# EAGLE schematic LED Cube V6 (EAGLE 8.4.0)
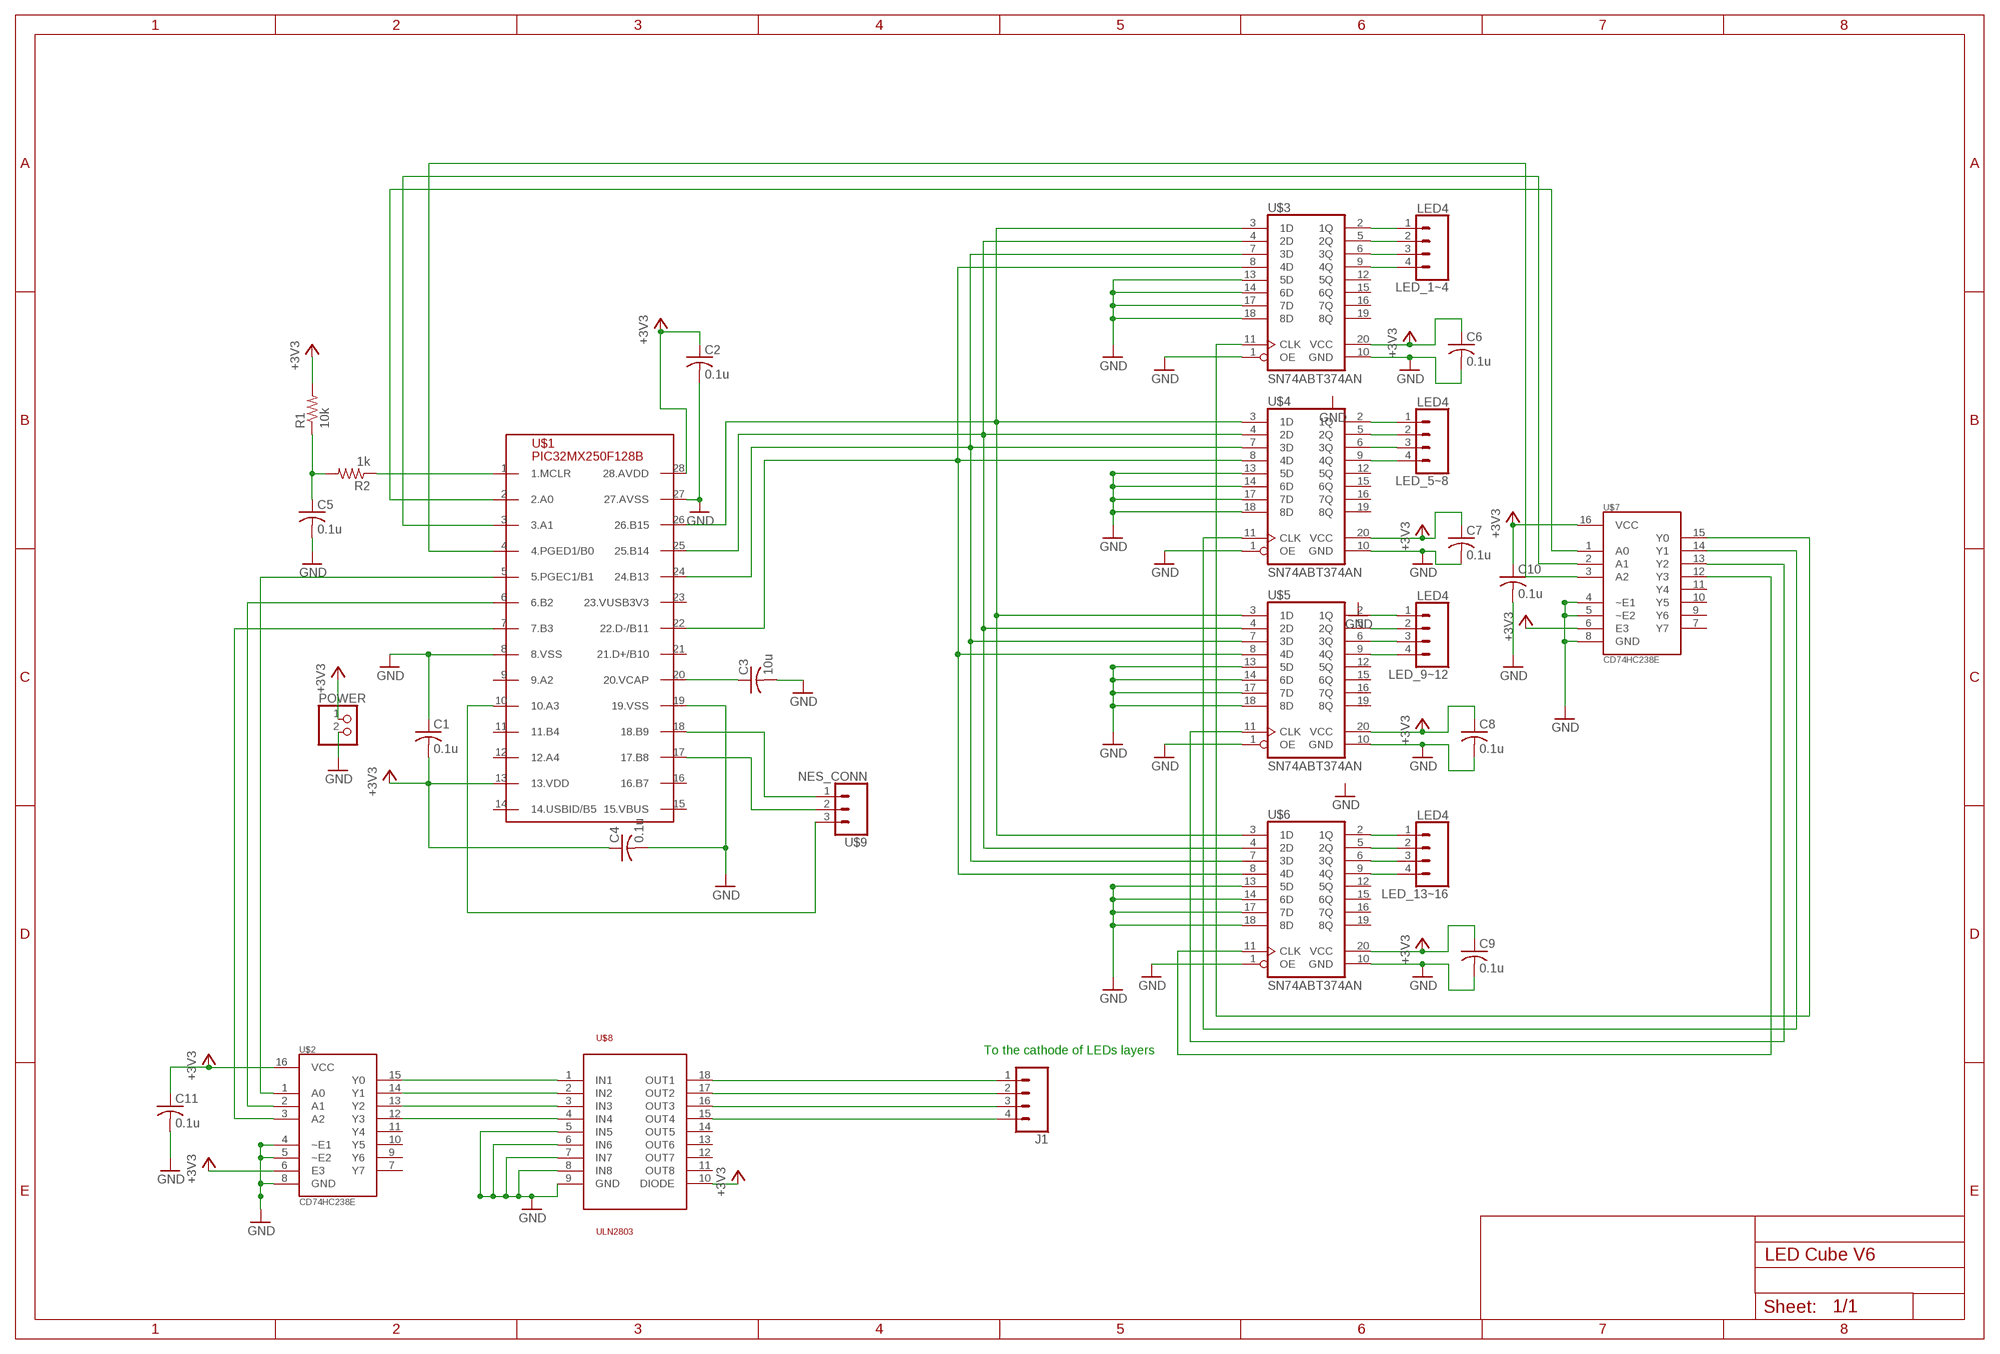
[diagram p0: schematic, sheet 1]

## Parts
C1  0.1u  C-US025-025X050  [C025-025X050]
C2  0.1u  C-US025-025X050  [C025-025X050]
C3  10u  C-US025-025X050  [C025-025X050]
C4  0.1u  C-US025-025X050  [C025-025X050]
C5  0.1u  C-US025-025X050  [C025-025X050]
C6  0.1u  C-US025-025X050  [C025-025X050]
C7  0.1u  C-US025-025X050  [C025-025X050]
C8  0.1u  C-US025-025X050  [C025-025X050]
C9  0.1u  C-US025-025X050  [C025-025X050]
C10  0.1u  C-US025-025X050  [C025-025X050]
C11  0.1u  C-US025-025X050  [C025-025X050]
J1  CONN_04  [1X04]
LED_1~4  LED4  [1X04]
LED_5~8  LED4  [1X04]
LED_9~12  LED4  [1X04]
LED_13~16  LED4  [1X04]
POWER  PINHD-1X2  [1X02]
R1  10k  R-US_0204/7  [0204/7]
R2  1k  R-US_0204/7  [0204/7]
U$1  PIC32MX250F128B  [DIL28-3]
U$2  CD74HC238E  [DIL16]
U$3  SN74ABT374AN  [DIL20]
U$4  SN74ABT374AN  [DIL20]
U$5  SN74ABT374AN  [DIL20]
U$6  SN74ABT374AN  [DIL20]
U$7  CD74HC238E  [DIL16]
U$8  ULN2803  [SO18L]
U$9  NES_CONN  [1X03]

## Nets
+3V3: C1.2 C2.1 C4.1 C6.1 C7.1 C8.1 C9.1 C10.1 C11.1 POWER.1 R1.2 U$1.13(13.VDD) U$1.28(28.AVDD) U$2.6(E3) U$2.16(VCC) U$3.20(VCC) U$4.20(VCC) U$5.20(VCC) U$6.20(VCC) U$7.6(E3) U$7.16(VCC) U$8.10(DIODE)
GND: C1.1 C2.2 C3.2 C4.2 C5.2 C6.2 C7.2 C8.2 C9.2 C10.2 C11.2 POWER.2 U$1.8(8.VSS) U$1.19(19.VSS) U$1.27(27.AVSS) U$2.4(~E1) U$2.5(~E2) U$2.8(GND) U$3.1(OE) U$3.10(GND) U$3.13(5D) U$3.14(6D) U$3.17(7D) U$3.18(8D) U$4.1(OE) U$4.10(GND) U$4.13(5D) U$4.14(6D) U$4.17(7D) U$4.18(8D) U$5.1(OE) U$5.10(GND) U$5.13(5D) U$5.14(6D) U$5.17(7D) U$5.18(8D) U$6.1(OE) U$6.10(GND) U$6.13(5D) U$6.14(6D) U$6.17(7D) U$6.18(8D) U$7.4(~E1) U$7.5(~E2) U$7.8(GND) U$8.5(IN5) U$8.6(IN6) U$8.7(IN7) U$8.8(IN8) U$8.9(GND)
LED1: LED_1~4.1 U$3.2(1Q)
N$1: U$2.15(Y0) U$8.1(IN1)
N$2: U$2.14(Y1) U$8.2(IN2)
N$3: U$2.13(Y2) U$8.3(IN3)
N$4: U$2.12(Y3) U$8.4(IN4)
N$5: U$1.10(10.A3) U$9.3
N$6: U$1.17(17.B8) U$9.2
N$7: U$1.18(18.B9) U$9.1
N$9: J1.1 U$8.18(OUT1)
N$10: J1.2 U$8.17(OUT2)
N$11: J1.3 U$8.16(OUT3)
N$12: J1.4 U$8.15(OUT4)
N$16: C3.1 U$1.20(20.VCAP)
N$17: U$1.5(5.PGEC1/B1) U$2.1(A0)
N$18: U$1.6(6.B2) U$2.2(A1)
N$19: U$1.7(7.B3) U$2.3(A2)
N$20: LED_9~12.1 U$5.2(1Q)
N$22: U$1.26(26.B15) U$3.3(1D) U$4.3(1D) U$5.3(1D) U$6.3(1D)
N$23: U$1.25(25.B14) U$3.4(2D) U$4.4(2D) U$5.4(2D) U$6.4(2D)
N$24: U$1.22(22.D-/B11) U$3.8(4D) U$4.8(4D) U$5.8(4D) U$6.8(4D)
N$25: U$1.24(24.B13) U$3.7(3D) U$4.7(3D) U$5.7(3D) U$6.7(3D)
N$28: C5.1 R1.1 R2.2
N$29: R2.1 U$1.1(1.MCLR)
N$31: U$3.11(CLK) U$7.15(Y0)
N$32: U$4.11(CLK) U$7.14(Y1)
N$33: U$1.3(3.A1) U$7.2(A1)
N$34: U$1.4(4.PGED1/B0) U$7.3(A2)
N$35: U$5.11(CLK) U$7.13(Y2)
N$36: U$6.11(CLK) U$7.12(Y3)
N$38: LED_9~12.2 U$5.5(2Q)
N$39: U$1.2(2.A0) U$7.1(A0)
N$40: LED_1~4.2 U$3.5(2Q)
N$41: LED_1~4.3 U$3.6(3Q)
N$42: LED_1~4.4 U$3.9(4Q)
N$43: LED_9~12.3 U$5.6(3Q)
N$44: LED_9~12.4 U$5.9(4Q)
N$47: LED_5~8.1 U$4.2(1Q)
N$48: LED_5~8.2 U$4.5(2Q)
N$49: LED_5~8.3 U$4.6(3Q)
N$50: LED_5~8.4 U$4.9(4Q)
N$63: LED_13~16.1 U$6.2(1Q)
N$64: LED_13~16.2 U$6.5(2Q)
N$65: LED_13~16.3 U$6.6(3Q)
N$66: LED_13~16.4 U$6.9(4Q)
Unconnected: U$1.9(9.A2) U$1.11(11.B4) U$1.12(12.A4) U$1.14(14.USBID/B5) U$1.15(15.VBUS) U$1.16(16.B7) U$1.21(21.D+/B10) U$1.23(23.VUSB3V3) U$2.7(Y7) U$2.9(Y6) U$2.10(Y5) U$2.11(Y4) U$3.12(5Q) U$3.15(6Q) U$3.16(7Q) U$3.19(8Q) U$4.12(5Q) U$4.15(6Q) U$4.16(7Q) U$4.19(8Q) U$5.12(5Q) U$5.15(6Q) U$5.16(7Q) U$5.19(8Q) U$6.12(5Q) U$6.15(6Q) U$6.16(7Q) U$6.19(8Q) U$7.7(Y7) U$7.9(Y6) U$7.10(Y5) U$7.11(Y4) U$8.11(OUT8) U$8.12(OUT7) U$8.13(OUT6) U$8.14(OUT5)

## Notes on the sheet
- To the cathode of LEDs layers

## Library data of the parts
C1-C11 = resistor:C-US: CAPACITOR, American symbol
J1 = SparkFun-Connectors:CONN_04: Multi connection point. Often used as Generic Header-pin footprint for 0.1 inch spaced/style header connections On any of the 0.1 inch spaced packages, you can populate with these: Break Away Headers - Straight <https://www.sparkfun.com/products/116> (PRT-00116) Break Away Male Headers - Right Angle <https://www.sparkfun.com/products/553> (PRT-00553) Female Headers <https://www.sparkfun.com/products/115> (PRT-00115) Break Away Headers - Machine Pin <https://www.sparkfun.com/products/117> (PRT-00117) Break Away Female Headers - Swiss Machine Pin <https://www.sparkfun.com/products/743> (PRT-00743) For SCREWTERMINALS and SPRING TERMINALS visit here: Screw Terimnals on SparkFun.com <https://www.sparkfun.com/search/results?term=Screw+Terminals> (5mm/3.5mm/2.54mm spacing) This device is also useful as a general connection point to wire up your design to another part of your project. Our various solder wires solder well into these plated through hole pads. Hook-Up Wire - Assortment (Stranded, 22 AWG) <https://www.sparkfun.com/products/11375> (PRT-11375) Hook-Up Wire - Assortment (Solid Core, 22 AWG) <https://www.sparkfun.com/products/11367> (PRT-11367) View the entire wire category on our website here <https://www.sparkfun.com/categories/141> Special notes: Molex polarized connector foot print use with SKU : PRT-08231 with associated crimp pins and housings. 1MM SMD Version SKU: PRT-10208; PROD_ID: CONN-09696
LED_1~4 LED_5~8 LED_9~12 LED_13~16 = ECE411:LED4
POWER = pinhead:PINHD-1X2: PIN HEADER
R1 R2 = resistor:R-US_: RESISTOR, American symbol
U$1 = ECE411:PIC32MX250F128B
U$2 U$7 = ECE411:CD74HC238E
U$3-U$6 = ECE411:SN74ABT374AN
U$8 = uln2803:ULN2803
U$9 = ECE411:NES_CONN

## Net classes
0 default: width 0.305 mm, drill 0.508 mm, clearance 0.254 mm